# EasyEDA Pro project PCB_fujica_schemat.eprj

# Board PCB2

Outline 45.61 x 22.77 mm; copper layers: Top Layer, Bottom Layer. Coordinates in mm from the lower left corner of the outline.
Outline path: 0,22.77 0,0 41.88,0 41.97,0 42.05,0 42.13,0.01 42.22,0.02 42.3,0.02 42.39,0.03 42.47,0.05 42.56,0.06 42.65,0.08 42.73,0.1 42.82,0.12 42.91,0.14 43,0.17 43.08,0.2 43.17,0.23 43.26,0.26 43.34,0.3 43.43,0.33 43.51,0.37 43.6,0.42 43.68,0.46 43.76,0.51 43.84,0.56 43.92,0.61 44,0.66 44.08,0.72 44.16,0.78 44.23,0.83 44.31,0.9 44.38,0.96 44.45,1.03 44.52,1.09 44.59,1.16 44.65,1.23 44.72,1.31 44.78,1.38 44.84,1.45 44.9,1.53 44.95,1.61 45.01,1.69 45.06,1.77 45.11,1.85 45.15,1.93 45.2,2.02 45.24,2.1 45.28,2.19 45.32,2.27 45.35,2.36 45.38,2.44 45.42,2.53 45.44,2.62 45.47,2.7 45.49,2.79 45.52,2.88 45.53,2.97 45.55,3.05 45.57,3.14 45.58,3.23 45.59,3.31 45.6,3.4 45.61,3.48 45.61,3.57 45.61,3.65 45.61,3.73 45.61,16.82 34.37,22.77 0,22.77
Stack: Top Layer 0.035mm / Dielectric1 1.51mm FR4 er 4.5 / Bottom Layer 0.035mm

## Design rules (mm)
template: JLCPCB Capability(Two Layers Board)
spacing copperThickness1oz (default): track to track 0.102, other pairs 0.152 to 0.3
spacing copperThickness2oz: track to track 0.203, other pairs 0.152 to 0.3
track width copperThickness1oz (default): min 0.127, default 0.254, max 2.54
track width copperThickness2oz: min 0.203, default 0.254, max 2.54
differential pair differentialPair (default): width min 0.127, default 0.254, max 2.54; gap min 0.152, default 0.152
via viaSize (default): diameter min 0.5, default 0.61, max 10; hole min 0.3, default 0.305, max 6.3

## Placement (name value [footprint] x y rotation side)
buzzer  -  [HDR-TH_1P-V-M_XKB_X4611WV-01I-C28D40]  27.57 14.69 0 top
C13  1uF  [CAP-TH_BD4.5-P2.50-D1.0-FD]  18.56 21.8 0 top
C14  47uF  [CAP-TH_BD5.0-P2.5-D0.5-FD]  27.57 3 270 top
C15  47uF  [CAP-TH_BD5.0-P2.5-D0.5-FD]  12.97 19.64 90 top
C16  47uF  [CAP-TH_BD5.0-P2.5-D0.5-FD]  3.44 19.64 90 top
C17_1  2.2uF  [CAP-TH_BD4.5-P2.50-D1.0-FD]  -4.18 20.91 90 top
C17_2  2.2uF  [CAP-TH_BD4.5-P2.50-D1.0-FD]  -4.18 18.37 90 top
H1  -  [HDR-TH_4P-P2.54-V-M]  24.78 13.03 270 top
NOREF  -  [Pad_e49]  1.41 16.84 90 top
NOREF#2  -  [Pad_e31]  35.57 1.98 0 top
NOREF#3  -  [Pad_e40]  1.41 5.8 90 top
NOREF#4  -  [Pad_e39]  1.41 7.32 90 top
NOREF#5  -  [Pad_e51]  1.41 21.54 90 top
NOREF#6  -  [Pad_e21]  40.4 1.98 0 top
NOREF#7  -  [Pad_e35]  29.6 1.98 0 top
NOREF#8  -  [Pad_e50]  1.41 20.02 90 top
NOREF#9  -  [Pad_e41]  1.41 4.27 90 top
NOREF#10  -  [Pad_e0]  41.8 1.98 0 top
NOREF#11  -  [Pad_e52]  1.41 18.37 90 top
NOREF#12  -  [Pad_e34]  31.13 1.98 0 top
NOREF#13  -  [Pad_e32]  34.05 1.98 0 top
NOREF#14  -  [Pad_e33]  32.65 1.98 0 top
NOREF#15  -  [Pad_e47]  1.41 14.05 90 top
NOREF#16  -  [Pad_e48]  1.41 15.57 90 top
NOREF#17  -  [Pad_e42]  1.41 2.87 90 top
NOREF#18  -  [Pad_e29]  38.62 1.98 0 top
NOREF#19  -  [Pad_e43]  1.41 1.35 90 top
NOREF#20  -  [Pad_e30]  37.22 1.98 0 top
NOREF#21  -  [Pad_e46]  4.2 1.35 90 top
R1  -  [RES-TH_BD1.9-L3.3-P7.30-D0.5]  43.96 6.56 270 top
R2  -  [RES-TH_BD1.9-L3.3-P7.30-D0.5]  43.96 13.8 270 top
R3  -  [RES-TH_BD1.9-L3.3-P7.30-D0.5]  18.81 13.16 270 top
R4  510Ω  [RES-TH_BD1.9-L3.3-P7.30-D0.5]  17.03 13.16 270 top
R5  510Ω  [RES-TH_BD1.9-L3.3-P7.30-D0.5]  15.25 13.16 270 top
R6  510Ω  [RES-TH_BD1.9-L3.3-P7.30-D0.5]  22.24 13.03 270 top
R7  -  [RES-TH_BD1.9-L3.3-P7.30-D0.5]  32.53 4.91 0 top
R8  -  [RES-TH_BD1.9-L3.3-P7.30-D0.5]  18.3 1.48 180 top
T1  NPN-sot-23  [SOT-23-3_L2.9-W1.3-P0.95-LS2.4-BR]  7.76 14.94 90 top
T2  NPN-sot-23  [SOT-23-3_L2.9-W1.3-P0.95-LS2.4-BR]  4.2 14.94 90 top
T3  NPN-sot-23  [SOT-23-3_L2.9-W1.3-P0.95-LS2.4-BR]  3.32 8.84 90 top
T4  NPN-sot-23  [SOT-23-3_L2.9-W1.3-P0.95-LS2.4-BR]  7.25 8.84 90 top
T5  PNP-sot-23  [SOT-23-3_L2.9-W1.3-P1.90-LS2.4-BR]  10.94 8.84 90 top

## Footprints (pads in the part's own frame, mm; a bottom-side part is the same pattern mirrored in y, then rotated)
CAP-TH_BD4.5-P2.50-D1.0-FD
  round 1.8 hole 1: 1(-1.25,0) 2(1.25,0)
CAP-TH_BD5.0-P2.5-D0.5-FD
  round 1 hole 0.914x0.5: 1(-1.25,0) 2(1.25,0)
HDR-TH_1P-V-M_XKB_X4611WV-01I-C28D40
  rect 1.4x1.4 hole 0.9: 1(0,0)
HDR-TH_4P-P2.54-V-M
  rect 1.7x1.7 hole 1.1: 1(-3.81,0)
  round 1.7 hole 1.1: 2(-1.27,0) 3(1.27,0) 4(3.81,0)
Pad_e0
  oval 1x1.5 hole 0.914x0.5: 1(0,0)
Pad_e21
  oval 1x1.5 hole 0.914x0.5: 2(0,0)
Pad_e29
  oval 1x1.5 hole 0.914x0.5: 2(0,0)
Pad_e30
  oval 1x1.5 hole 0.914x0.5: 2(0,0)
Pad_e31
  oval 1x1.5 hole 0.914x0.5: 2(0,0)
Pad_e32
  oval 1x1.5 hole 0.914x0.5: 2(0,0)
Pad_e33
  oval 1x1.5 hole 0.914x0.5: 2(0,0)
Pad_e34
  oval 1x1.5 hole 0.914x0.5: 2(0,0)
Pad_e35
  oval 1x1.5 hole 0.914x0.5: 2(0,0)
Pad_e39
  oval 1x1.5 hole 0.914x0.5: 39(0,0)
Pad_e40
  oval 1x1.5 hole 0.914x0.5: 38(0,0)
Pad_e41
  oval 1x1.5 hole 0.914x0.5: 37(0,0)
Pad_e42
  oval 1x1.5 hole 0.914x0.5: 36(0,0)
Pad_e43
  oval 1x1.5 hole 0.914x0.5: 35(0,0)
Pad_e46
  oval 1x1.5 hole 0.914x0.5: 34(0,0)
Pad_e47
  oval 1x1.5 hole 0.914x0.5: 40(0,0)
Pad_e48
  oval 1x1.5 hole 0.914x0.5: 741(0,0)
Pad_e49
  oval 1x1.5 hole 0.914x0.5: 42(0,0)
Pad_e50
  oval 1x1.5 hole 0.914x0.5: 44(0,0)
Pad_e51
  oval 1x1.5 hole 0.914x0.5: 45(0,0)
Pad_e52
  oval 1x1.5 hole 0.914x0.5: 743(0,0)
RES-TH_BD1.9-L3.3-P7.30-D0.5
  round 1 hole 0.7x0.5: 1(-2.572,0) 2(2.541,0)
SOT-23-3_L2.9-W1.3-P0.95-LS2.4-BR
  rect 1.25x0.7 smd: 1(1,-0.95) 2(1,0.95) 3(-1,0)
SOT-23-3_L2.9-W1.3-P1.90-LS2.4-BR
  rect 1.25x0.7 smd: 1(1,-0.95) 2(1,0.95) 3(-1,0)

## Nets
GND: C13.1 C15.2 C16.2 C17_1.1 C17_2.2 NOREF#8.44 T2.2
7-45: C17_1.2 R3.1 T2.1
$C14_1: C14.1 R5.2 T5.2
$R1_1: R1.1 R2.2 T5.1
$R8_2: R8.2 T4.1
BLUE_7-15: NOREF#2.2 R8.1
BLUE_7-37: NOREF#9.37 T4.2
GREEN_7-13: buzzer.1 NOREF#7.2
GREEN_7-24: C13.2 NOREF#5.45 NOREF#10.1 R2.1 R4.1 R5.1 R6.1
GREEN_7-34: C14.2 C17_2.1 NOREF#21.34 R7.2 T1.2 T2.3 T3.1 T3.2 T4.3
GREY_7-12: NOREF#14.2 R3.2
GREY_7-42: NOREF.42
ORANGE_7-18: H1.3 NOREF#18.2
ORANGE_7-35: NOREF#19.35 T5.3
ORANGE_7-36: C15.1 NOREF#17.36 R6.2
RED_7-19: NOREF#6.2 R1.2
RED_7-38: C16.1 NOREF#3.38 R4.2
WHITE_7-11: NOREF#12.2 T1.1
WHITE_7-16: H1.4 NOREF#20.2
WHITE_7-40: NOREF#15.40 T1.3
YELLOW_7-14: NOREF#13.2 R7.1
YELLOW_7-39: NOREF#4.39 T3.3

Pads without a net: H1 1 2; NOREF#11 743; NOREF#16 741

## Via types
v1: diameter 1, hole 0.5, Top Layer to Bottom Layer, 18 vias

## Routing (per net, layer and track width the routed paths; a pad name or vN(x,y) marks a point on that pad's centre or on a via; arc(x,y) is an arc through that point)
GND: length 20.1
  Top Layer w0.254: NOREF#8.44 C16.2 4.97,20.89 4.97,19.13 T2.2 ; C15.2 12.69,21.16 7.63,21.16 6.81,20.34 6.81,15.94
(no net):
  vias: v1(8.14,3.25) v1(9.03,12.27) v1(9.79,8.07) v1(10.25,19.51) v1(12.71,6.94) v1(17.67,21.8) v1(19.57,21.8) v1(20.59,13.03) v1(21.1,8.46) v1(21.1,3.38) v1(26.05,20.15)
$R1_1: length 47.5
  Top Layer w0.254: T5.1 14.11,7.83 14.11,6.43 15.89,4.91 22.11,4.91 30.37,9.22 38.37,9.22 38.37,3.89 42.81,3.89 R1.1 R2.2
$R8_2: length 18
  Top Layer w0.254: 15.51,4.14 18.43,4.14 v1(19.06,3.38) ; 15.51,4.14 R8.2 ; 15.51,4.14 13.22,5.41 9.16,5.54 9.16,7.62 arc(9.01,8.07) 9.16,8.52 9.16,8.84 T4.1
BLUE_7-15: length 18.4
  Top Layer w0.254: v1(33.92,6.56) 33.92,7.57 30.49,7.57 26.3,5.16 26.18,1.35 R8.1
BLUE_7-37:
  vias: v1(6.11,8.57)
GREEN_7-24: length 42.8
  Top Layer w0.254: NOREF#10.1 44.08,1.98 45.23,3.13 45.23,15.1 R2.1 ; R6.1 15.38,21.92 5.09,21.92 NOREF#5.45 ; R5.1 R4.1
GREEN_7-34: length 29
  Top Layer w0.254: 3.88,10.18 4.44,9.62 4.44,5.94 4.71,5.67 v1(6.11,5.67) ; 35.07,4.91 35.07,8.33 30.37,8.33 24.27,4.91 v1(24.27,3) ; 6.24,11.82 2.61,11.82 2.43,11.64 2.43,9.9 T3.2
ORANGE_7-36: length 7.9
  Top Layer w0.254: C15.1 10.83,20.53 9.16,20.53 8.14,19.51 v1(8.14,17.73)
WHITE_7-11: length 1.7
  Top Layer w0.254: T1.1 9.65,15.94 v1(10.17,16.46)
YELLOW_7-14: length 5.9
  Top Layer w0.254: NOREF#13.2 33.67,3.76 31.38,3.76 29.95,4.91
YELLOW_7-39: length 2.1
  Top Layer w0.254: T3.3 2.79,7.32 NOREF#4.39

## Text on the board
Bottom Layer: 4 | T3 | C | 3 | 2 | E | ML | B | 1 | T2 | T4 | T1 | T5 | MD | R6 | R5 | R8 | R4 | R3 | R7 | R2 | R1 | Main Latch | C17 | C16 | C15 | C13 | C14 | β Mg | α Mg | γ Mg | ε Mg
Document Layer: 45 | 44 | 43 | 42 | 41 | 40 | 39 | 38 | 37 | 36 | 35 | 34 | 13 | 11 | 12 | 14 | 15 | 16 | 18 | 19 | 24
Top Layer: TOP | BOTTOM | 88A | 107A | KL98A-4
Drill Drawing Layer: 1 | 2 | 3 | 5 | 7 | 8 | 6 | 9 | 11 | 10 | 12 | 26 | 13 | 14 | 20 | 15 | 21 | 16 | 31 | 22 | 17 | 38 | 23 | 18 | 28 | 39 | 24 | 29 | 32 | 27 | 25 | 19 | 30 | 40 | 33 | 34 | 36 | 35 | 37 | 42 | 43 | 44 | 41
